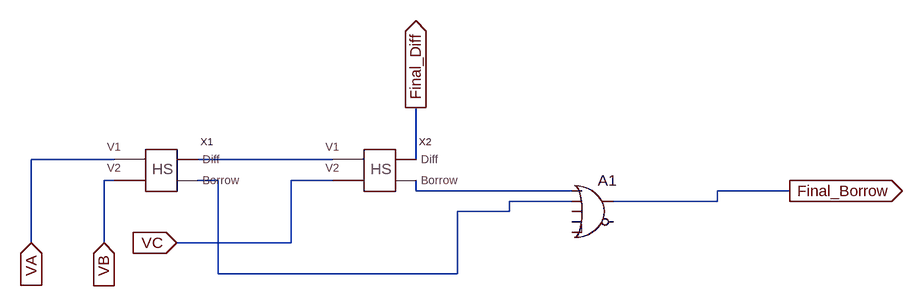
[diagram p0: schematic Full subtractor schematic.asc]
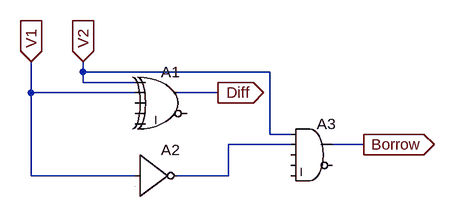
[diagram p1: sub-circuit hs.asc]
Full subtractor schematic.asc, the LTspice schematic file:
Version 4
SHEET 1 880 680
WIRE -688 128 -816 128
WIRE -352 128 -560 128
WIRE -224 128 -224 48
WIRE -688 160 -704 160
WIRE -528 160 -560 160
WIRE -352 160 -416 160
WIRE -224 176 -224 160
WIRE 16 176 -224 176
WIRE 352 176 240 176
WIRE 16 192 -80 192
WIRE 240 192 240 176
WIRE 240 192 80 192
WIRE -80 208 -80 192
WIRE -80 208 -160 208
WIRE -816 256 -816 128
WIRE -704 256 -704 160
WIRE -416 256 -416 160
WIRE -416 256 -592 256
WIRE -528 304 -528 160
WIRE -160 304 -160 208
WIRE -160 304 -528 304
FLAG 352 176 Final_Borrow
IOPIN 352 176 Out
FLAG -224 48 Final_Diff
IOPIN -224 48 Out
FLAG -816 256 VA
IOPIN -816 256 In
FLAG -704 256 VB
IOPIN -704 256 In
FLAG -592 256 VC
IOPIN -592 256 In
SYMBOL HS -592 144 R0
SYMATTR InstName X1
SYMBOL HS -256 144 R0
SYMATTR InstName X2
SYMBOL Digital\\or 48 144 R0
SYMATTR InstName A1

hs.asc, the sub-circuit schematic file:
Version 4
SHEET 1 880 680
WIRE 64 96 64 80
WIRE 352 96 64 96
WIRE 64 112 64 96
WIRE 144 112 64 112
WIRE -16 128 -16 80
WIRE 144 128 -16 128
WIRE 272 128 208 128
WIRE 352 192 352 96
WIRE 384 192 352 192
WIRE 384 208 288 208
WIRE 496 208 448 208
WIRE -16 256 -16 128
WIRE 144 256 -16 256
WIRE 288 256 288 208
WIRE 288 256 208 256
FLAG -16 80 V1
IOPIN -16 80 In
FLAG 64 80 V2
IOPIN 64 80 In
FLAG 272 128 Diff
IOPIN 272 128 Out
FLAG 496 208 Borrow
IOPIN 496 208 Out
SYMBOL Digital\\xor 192 80 R0
SYMATTR InstName A1
SYMBOL Digital\\inv 144 192 R0
SYMATTR InstName A2
SYMBOL Digital\\and 416 160 R0
SYMATTR InstName A3

The netlist it stands for:
* Full subtractor schematic.asc
XX1 VA VB N001 N002 hs
XX2 N001 VC Final_Diff N003 hs
A1 N003 N002 0 0 0 0 Final_Borrow 0 OR

* block symbol definitions
.subckt hs V1 V2 Diff Borrow
A1 V2 V1 0 0 0 0 Diff 0 XOR
A2 V1 0 0 0 0 N001 0 0 BUF
A3 V2 N001 0 0 0 0 Borrow 0 AND
.ends hs

.backanno
.end